# EAGLE design main (EAGLE 9.6.2)

## Sheet 1 of 4
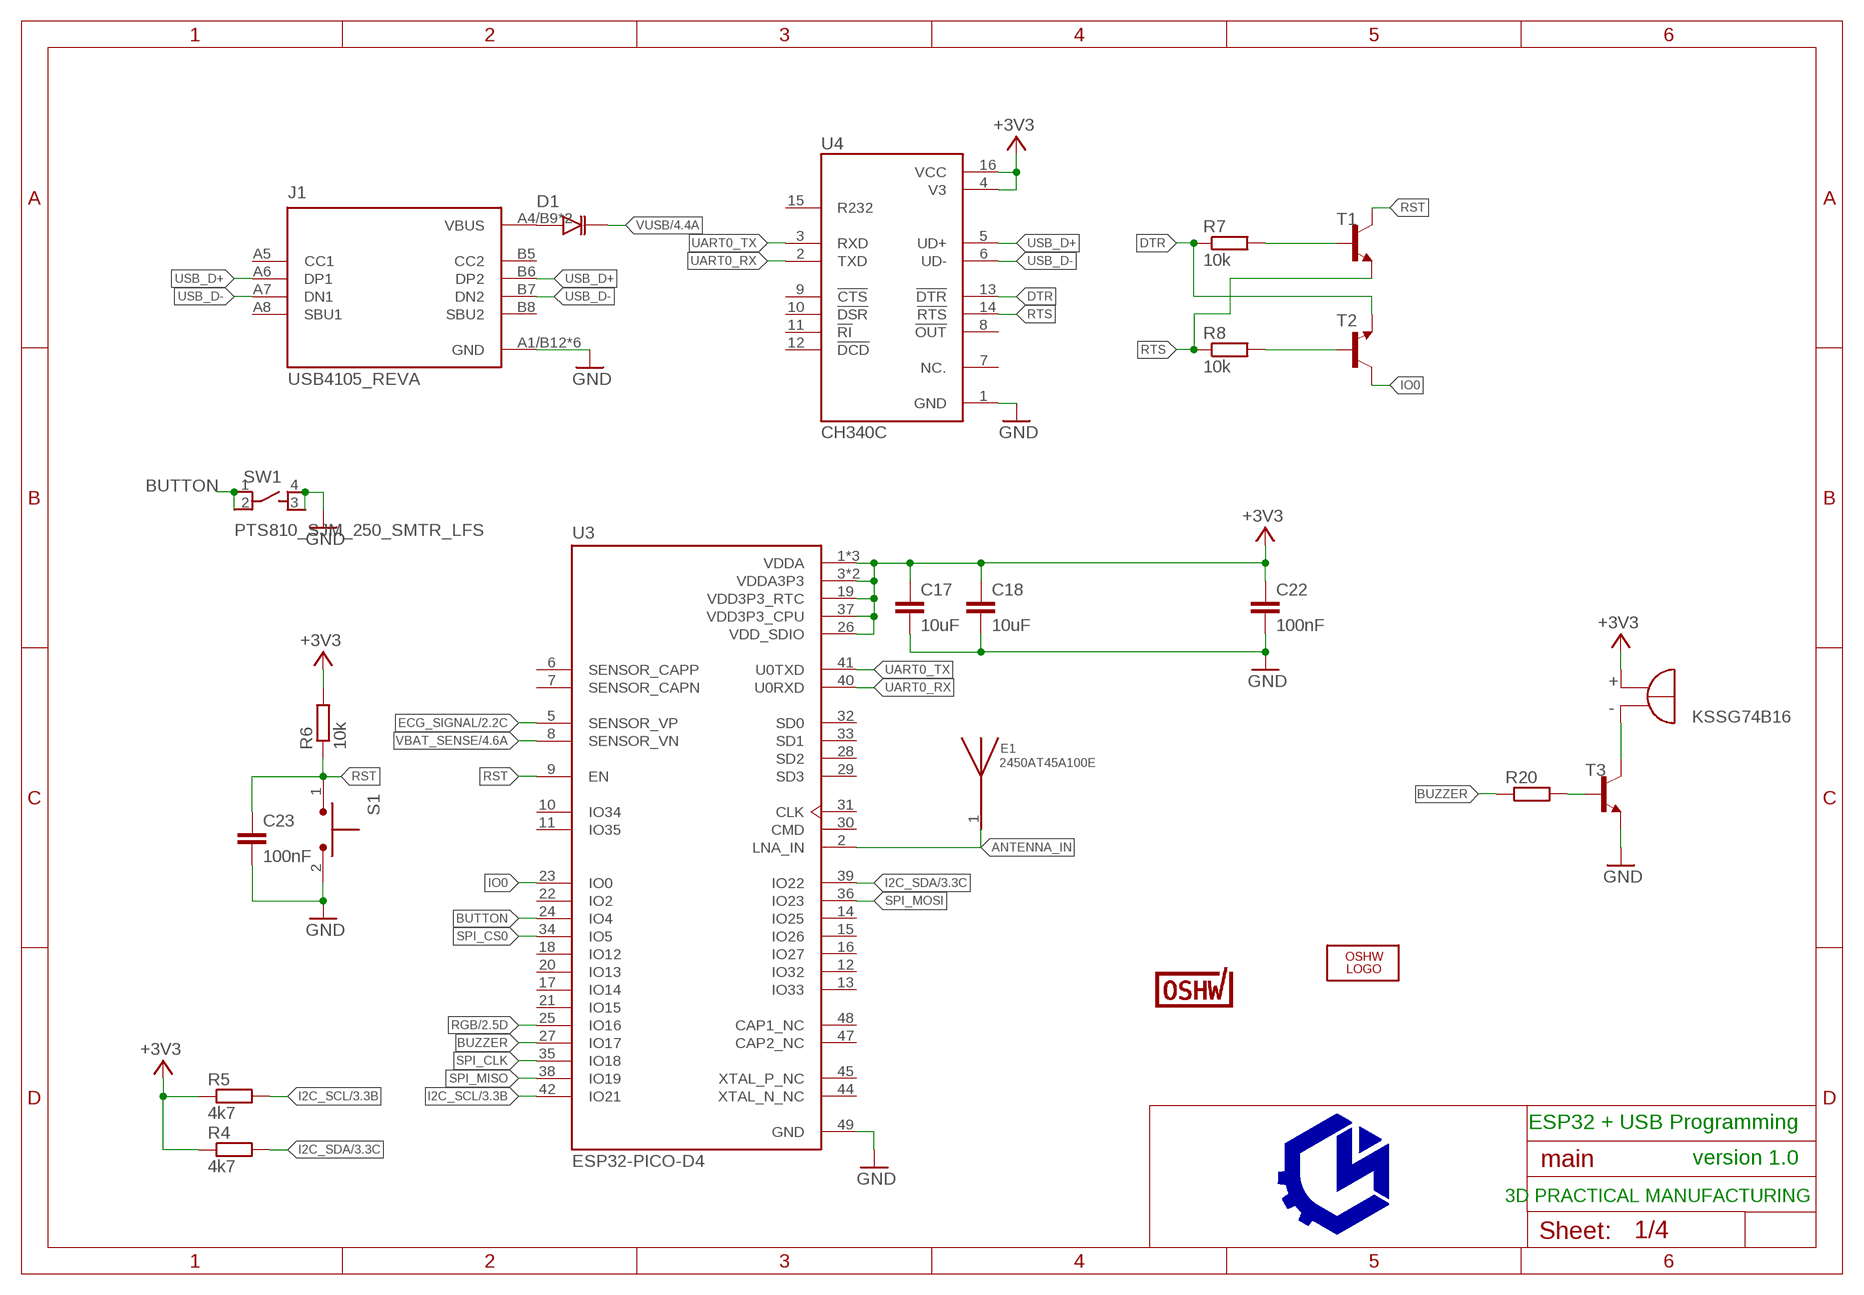
[diagram p0: schematic, sheet 1]

### Parts
C17  10uF  C-EUC0603  [C0603]
C18  10uF  C-EUC0603  [C0603]
C22  100nF  C-EUC0603  [C0603]
C23  100nF  C-EUC0603  [C0603]
D1  ZMV829BTA  [SOD2512X116N]
E1  2450AT45A100E  [ANT_2450AT45A100E]
J1  USB4105_REVA  [GCT_USB4105_REVA]
LOGO2  OSHW_LOGO_FILLX0200-NT  [OSHW_FILLX200_NOTEXT]
LS1  KSSG74B16  [XDCR_KSSG74B16]
R4  4k7  R-EU_R0603  [R0603]
R5  4k7  R-EU_R0603  [R0603]
R6  10k  R-EU_R0603  [R0603]
R7  10k  R-EU_R0603  [R0603]
R8  10k  R-EU_R0603  [R0603]
R20  R-EU_R0603  [R0603]
S1  TL1015AF160QG  [SW_TL1015AF160QG]
SW1  PTS810_SJM_250_SMTR_LFS  [SW_PTS810_SJM_250_SMTR_LFS]
T1  MMBT4401LT1-NPN-SOT23-BEC  [SOT23-BEC]
T2  MMBT4401LT1-NPN-SOT23-BEC  [SOT23-BEC]
T3  MMBT4401LT1-NPN-SOT23-BEC  [SOT23-BEC]
U3  ESP32-PICO-D4  [PQFN50P700X700X104-49N]
U4  CH340C  [SOIC127P600X180-16N]
U$10  CERT-SMALL  [CERT-SMALL-SILK]

### Nets
+3V3: C17.1 C18.1 C22.1 LS1.P(POS) R4.1 R5.1 R6.2 U3.1(VDDA) U3.3(VDDA3P3) U3.4(VDDA3P3) U3.19(VDD3P3_RTC) U3.26(VDD_SDIO) U3.37(VDD3P3_CPU) U3.43(VDDA) U3.46(VDDA) U4.4(V3) U4.16(VCC) ; also sheet 2,3,4
ANTENNA_IN: E1.1 U3.2(LNA_IN)
BUTTON: SW1.1 SW1.2 U3.24(IO4)
BUZZER: R20.1 U3.27(IO17)
DTR: R7.1 T2.E U4.13(!DTR)
ECG_SIGNAL: U3.5(SENSOR_VP) ; also sheet 2
GND: C17.2 C18.2 C22.2 C23.2 J1.A1/B12(GND) J1.B1/A12(GND) J1.G1(GND) J1.G2(GND) J1.G3(GND) J1.G4(GND) S1.2 SW1.3 SW1.4 T3.E U3.49(GND) U4.1(GND) ; also sheet 2,3,4
I2C_SCL: R5.2 U3.42(IO21) ; also sheet 3
I2C_SDA: R4.2 U3.39(IO22) ; also sheet 3
IO0: T2.C U3.23(IO0)
N$1: R7.2 T1.B
N$2: R8.2 T2.B
N$5: R20.2 T3.B
N$20: D1.A J1.A4/B9(VBUS) J1.B4/A9(VBUS)
N$22: LS1.N(NEG) T3.C
RGB: U3.25(IO16) ; also sheet 2
RST: C23.1 R6.1 S1.1 T1.C U3.9(EN)
RTS: R8.1 T1.E U4.14(!RTS)
SPI_CLK: U3.35(IO18)
SPI_CS0: U3.34(IO5)
SPI_MISO: U3.38(IO19)
SPI_MOSI: U3.36(IO23)
UART0_RX: U3.40(U0RXD) U4.2(TXD)
UART0_TX: U3.41(U0TXD) U4.3(RXD)
USB_D+: J1.A6(DP1) J1.B6(DP2) U4.5(UD+)
USB_D-: J1.A7(DN1) J1.B7(DN2) U4.6(UD-)
VBAT_SENSE: U3.8(SENSOR_VN) ; also sheet 4
VUSB: D1.K ; also sheet 4
Unconnected: J1.A5(CC1) J1.A8(SBU1) J1.B5(CC2) J1.B8(SBU2) U3.6(SENSOR_CAPP) U3.7(SENSOR_CAPN) U3.10(IO34) U3.11(IO35) U3.12(IO32) U3.13(IO33) U3.14(IO25) U3.15(IO26) U3.16(IO27) U3.17(IO14) U3.18(IO12) U3.20(IO13) U3.21(IO15) U3.22(IO2) U3.28(SD2) U3.29(SD3) U3.30(CMD) U3.31(CLK) U3.32(SD0) U3.33(SD1) U3.44(XTAL_N_NC) U3.45(XTAL_P_NC) U3.47(CAP2_NC) U3.48(CAP1_NC) U4.7(NC.) U4.8(!OUT) U4.9(!CTS) U4.10(!DSR) U4.11(!RI) U4.12(!DCD) U4.15(R232)

### Notes on the sheet
- ESP32 + USB Programming
- version 1.0
- 3D PRACTICAL MANUFACTURING

## Sheet 2 of 4
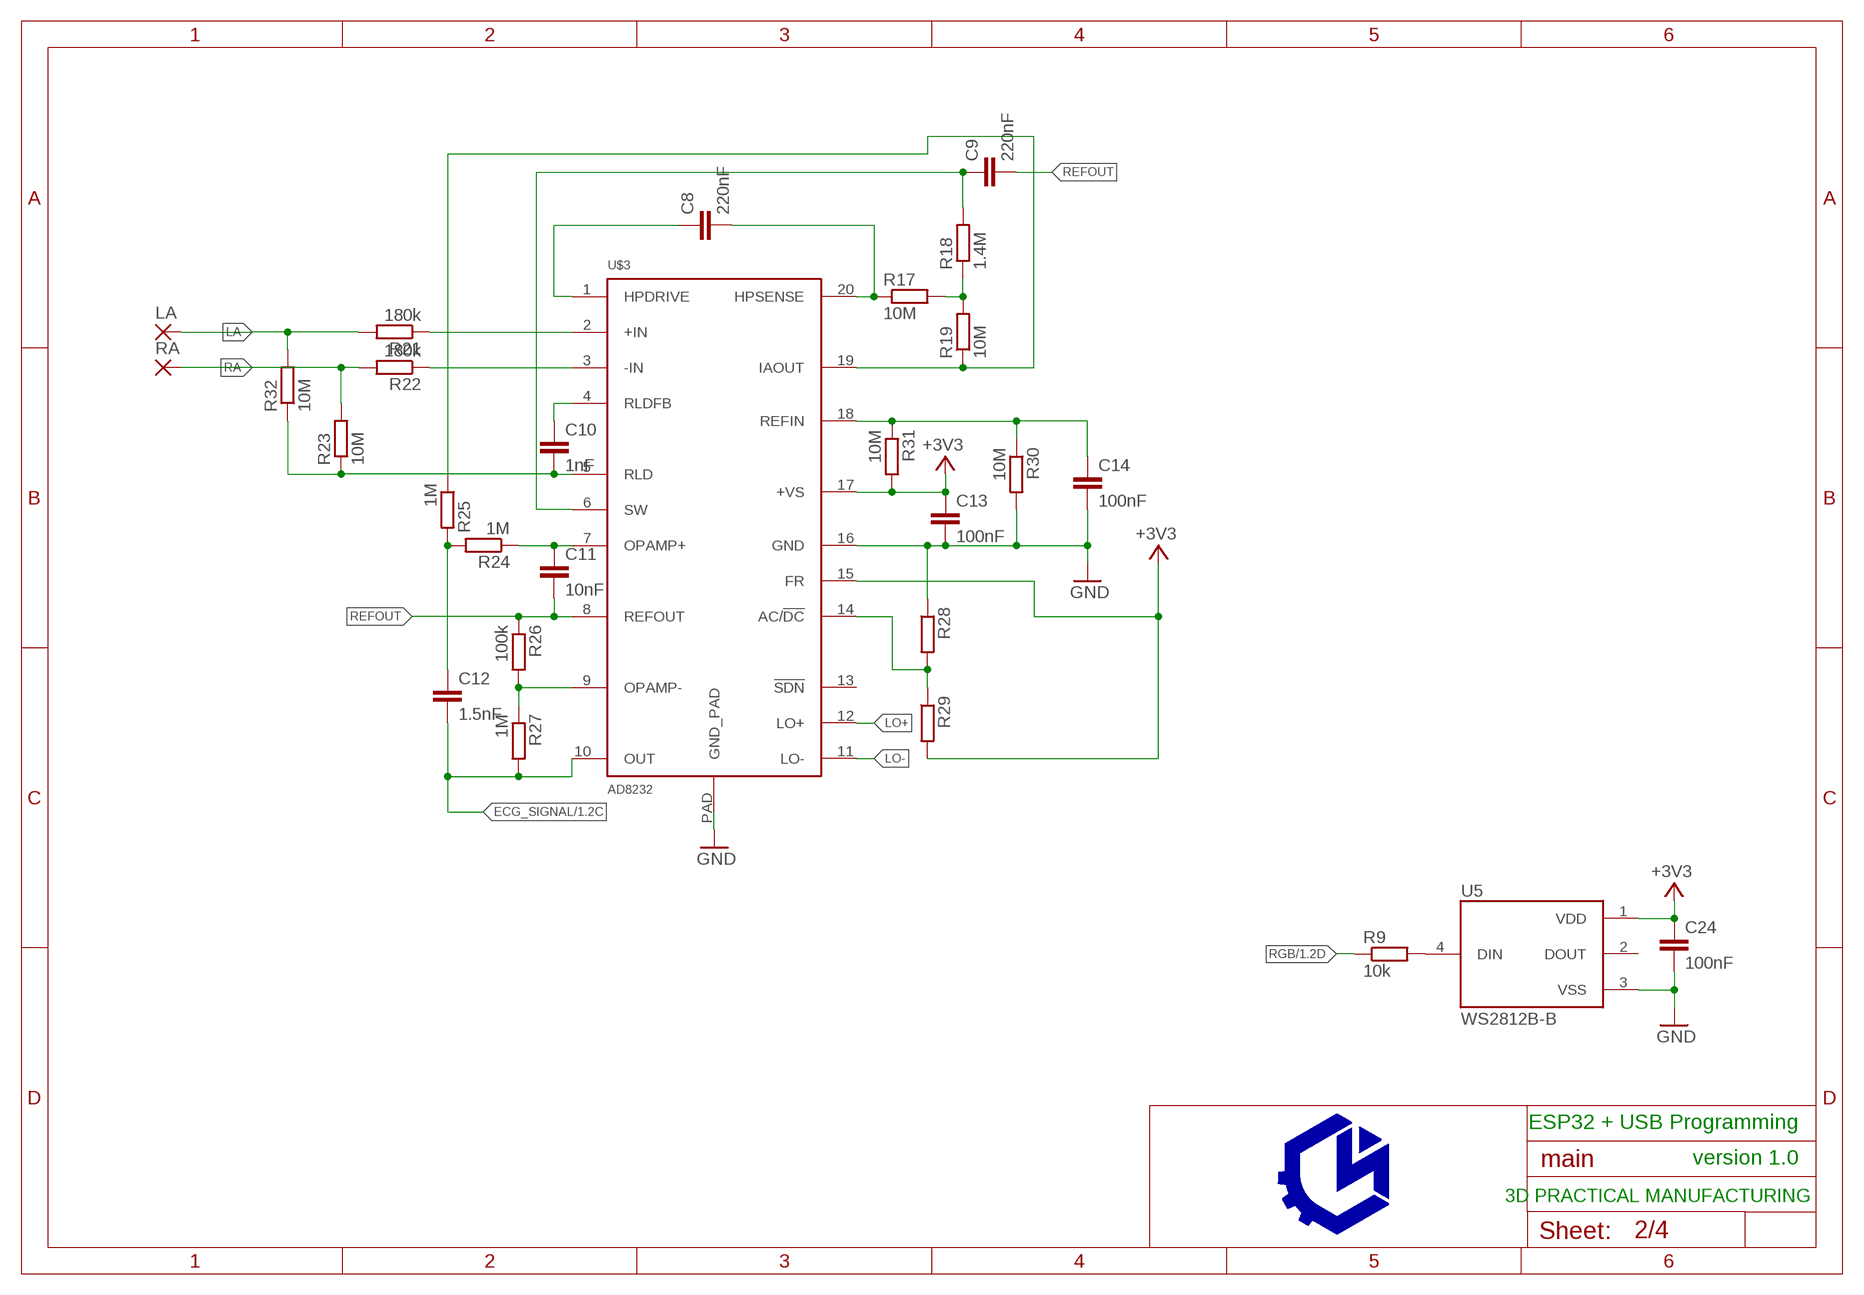
[diagram p1: schematic, sheet 2]

### Parts
C8  220nF  C-EUC0603  [C0603]
C9  220nF  C-EUC0603  [C0603]
C10  1nF  C-EUC0603  [C0603]
C11  10nF  C-EUC0603  [C0603]
C12  1.5nF  C-EUC0603  [C0603]
C13  100nF  C-EUC0603  [C0603]
C14  100nF  C-EUC0603  [C0603]
C24  100nF  C-EUC0603  [C0603]
LA  SMD2  [SMD1,27-2,54]
R9  10k  R-EU_R0603  [R0603]
R17  10M  R-EU_R0603  [R0603]
R18  1.4M  R-EU_R0603  [R0603]
R19  10M  R-EU_R0603  [R0603]
R21  180k  R-EU_R0603  [R0603]
R22  180k  R-EU_R0603  [R0603]
R23  10M  R-EU_R0603  [R0603]
R24  1M  R-EU_R0603  [R0603]
R25  1M  R-EU_R0603  [R0603]
R26  100k  R-EU_R0603  [R0603]
R27  1M  R-EU_R0603  [R0603]
R28  R-EU_R0603  [R0603]
R29  R-EU_R0603  [R0603]
R30  10M  R-EU_R0603  [R0603]
R31  10M  R-EU_R0603  [R0603]
R32  10M  R-EU_R0603  [R0603]
RA  SMD2  [SMD1,27-2,54]
U5  WS2812B-B  [LED_WS2812B-B]
U$3  AD8232  [LFCSP_20]

### Nets
+3V3: C13.1 C24.1 R29.2 R31.2 U5.1(VDD) U$3.15(FR) U$3.17(+VS) ; also sheet 1,3,4
ECG_SIGNAL: C12.2 R27.2 U$3.10(OUT) ; also sheet 1
GND: C13.2 C14.2 C24.2 R28.1 R30.2 U5.3(VSS) U$3.16(GND) U$3.PAD(GND_PAD) ; also sheet 1,3,4
LA: LA.1(P) R21.2 R32.2
LO+: U$3.12(LO+)
LO-: U$3.11(LO-)
N$3: R9.2 U5.4(DIN)
N$10: C8.2 R17.1 U$3.20(HPSENSE)
N$11: C8.1 U$3.1(HPDRIVE)
N$12: R19.1 R25.1 U$3.19(IAOUT)
N$13: R17.2 R18.1 R19.2
N$14: C9.1 R18.2 U$3.6(SW)
N$16: C12.1 R24.2 R25.2
N$18: R21.1 U$3.2(+IN)
N$19: R22.1 U$3.3(-IN)
N$30: C10.1 U$3.4(RLDFB)
N$31: C10.2 R23.1 R32.1 U$3.5(RLD)
N$34: C11.1 R24.1 U$3.7(OPAMP+)
N$36: R26.2 R27.1 U$3.9(OPAMP-)
N$38: R28.2 R29.1 U$3.14(AC/!DC)
N$39: C14.1 R30.1 R31.1 U$3.18(REFIN)
RA: R22.2 R23.2 RA.1(P)
REFOUT: C9.2 C11.2 R26.1 U$3.8(REFOUT)
RGB: R9.1 ; also sheet 1
Unconnected: U5.2(DOUT) U$3.13(!SDN)

### Notes on the sheet
- ESP32 + USB Programming
- version 1.0
- 3D PRACTICAL MANUFACTURING

## Sheet 3 of 4
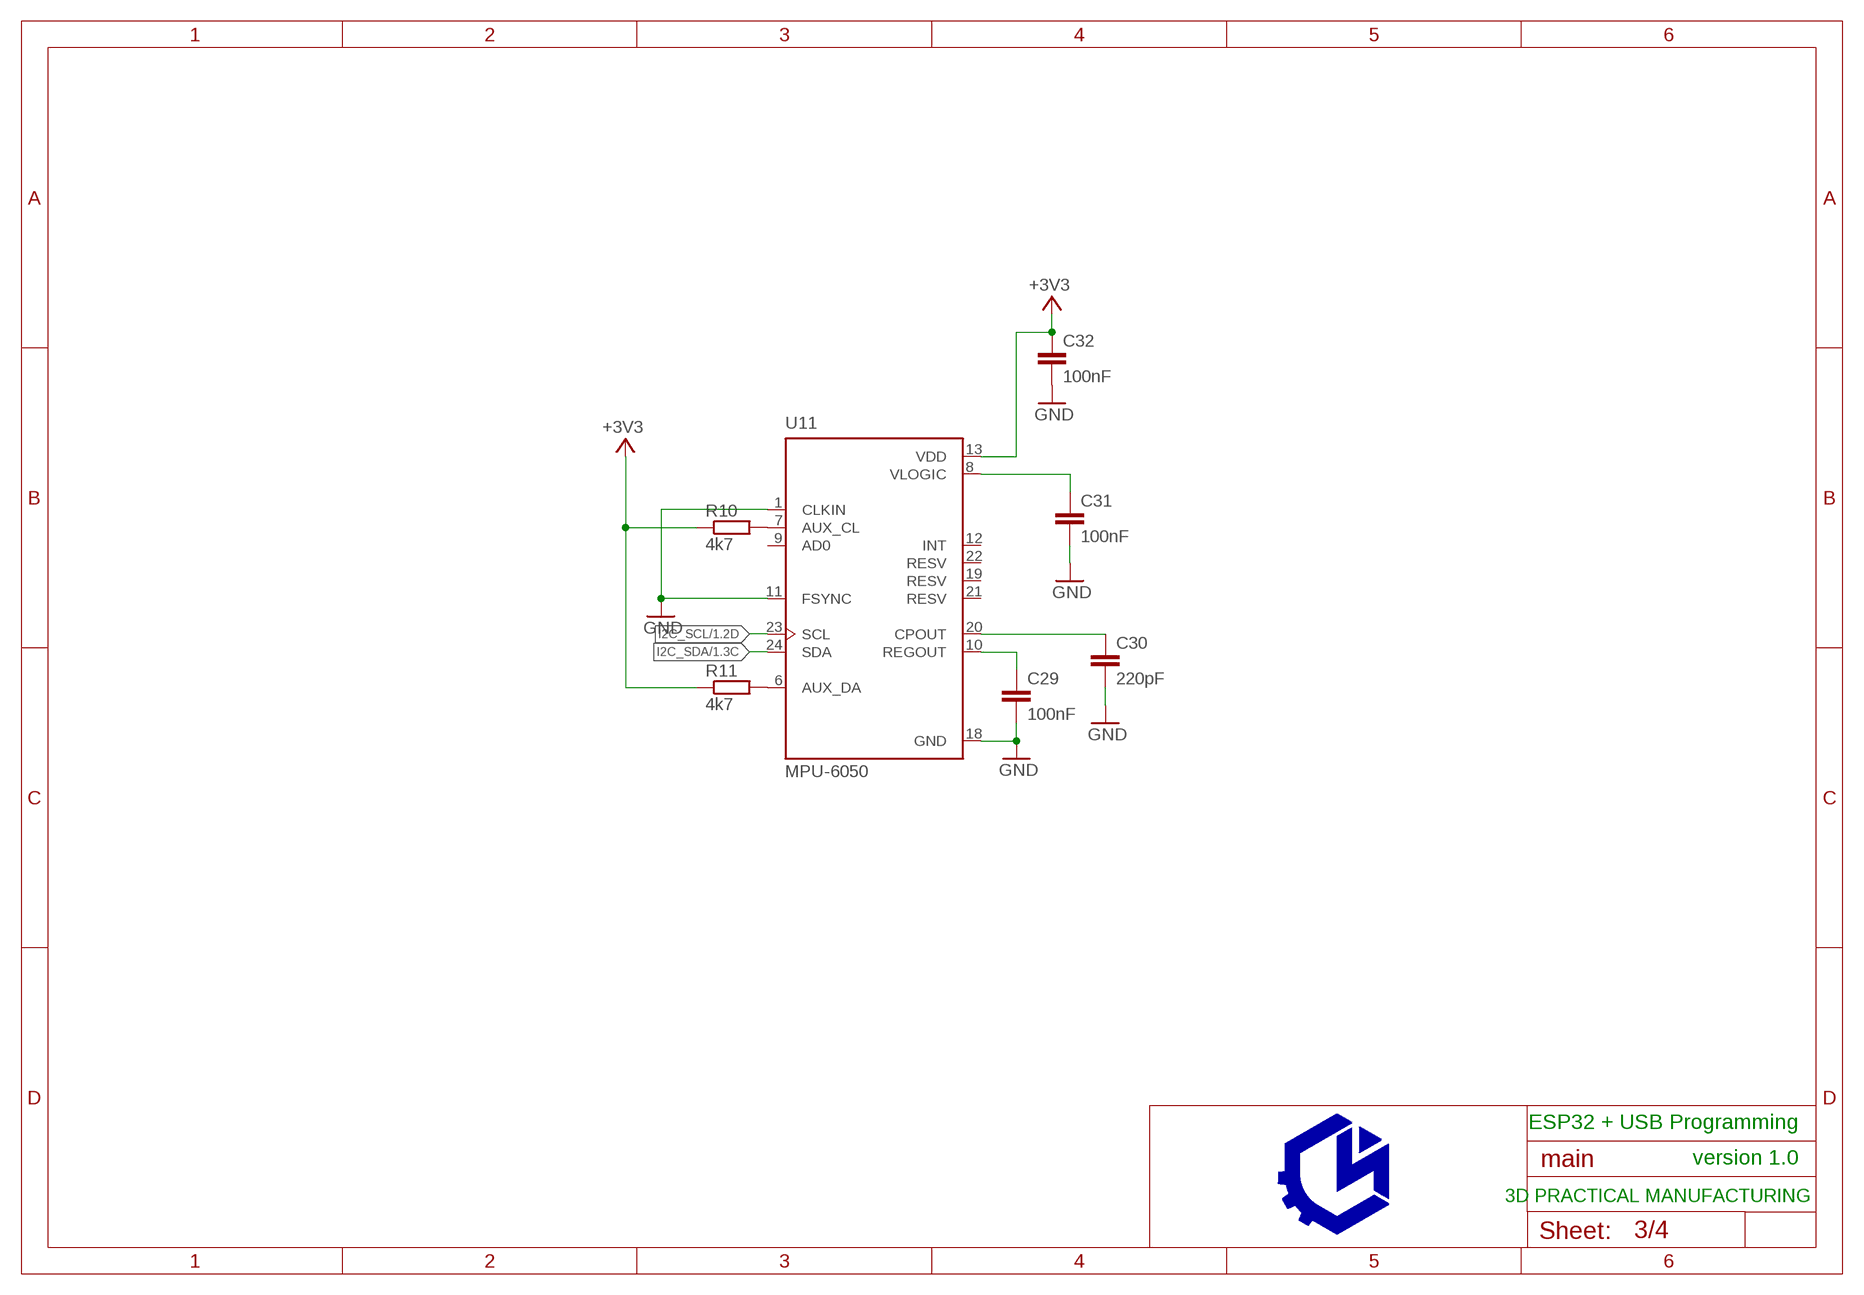
[diagram p2: schematic, sheet 3]

### Parts
C29  100nF  C-EUC0603  [C0603]
C30  220pF  C-EUC0603  [C0603]
C31  100nF  C-EUC0603  [C0603]
C32  100nF  C-EUC0603  [C0603]
R10  4k7  R-EU_R0603  [R0603]
R11  4k7  R-EU_R0603  [R0603]
U11  MPU-6050  [QFN50P400X400X95-24N]

### Nets
+3V3: C32.1 R10.1 R11.1 U11.13(VDD) ; also sheet 1,2,4
GND: C29.2 C30.2 C31.2 C32.2 U11.1(CLKIN) U11.11(FSYNC) U11.18(GND) ; also sheet 1,2,4
I2C_SCL: U11.23(SCL) ; also sheet 1
I2C_SDA: U11.24(SDA) ; also sheet 1
N$8: C29.1 U11.10(REGOUT)
N$24: R10.2 U11.7(AUX_CL)
N$25: R11.2 U11.6(AUX_DA)
N$26: C31.1 U11.8(VLOGIC)
N$27: C30.1 U11.20(CPOUT)
Unconnected: U11.9(AD0) U11.12(INT) U11.19(RESV) U11.21(RESV) U11.22(RESV)

### Notes on the sheet
- ESP32 + USB Programming
- version 1.0
- 3D PRACTICAL MANUFACTURING

## Sheet 4 of 4
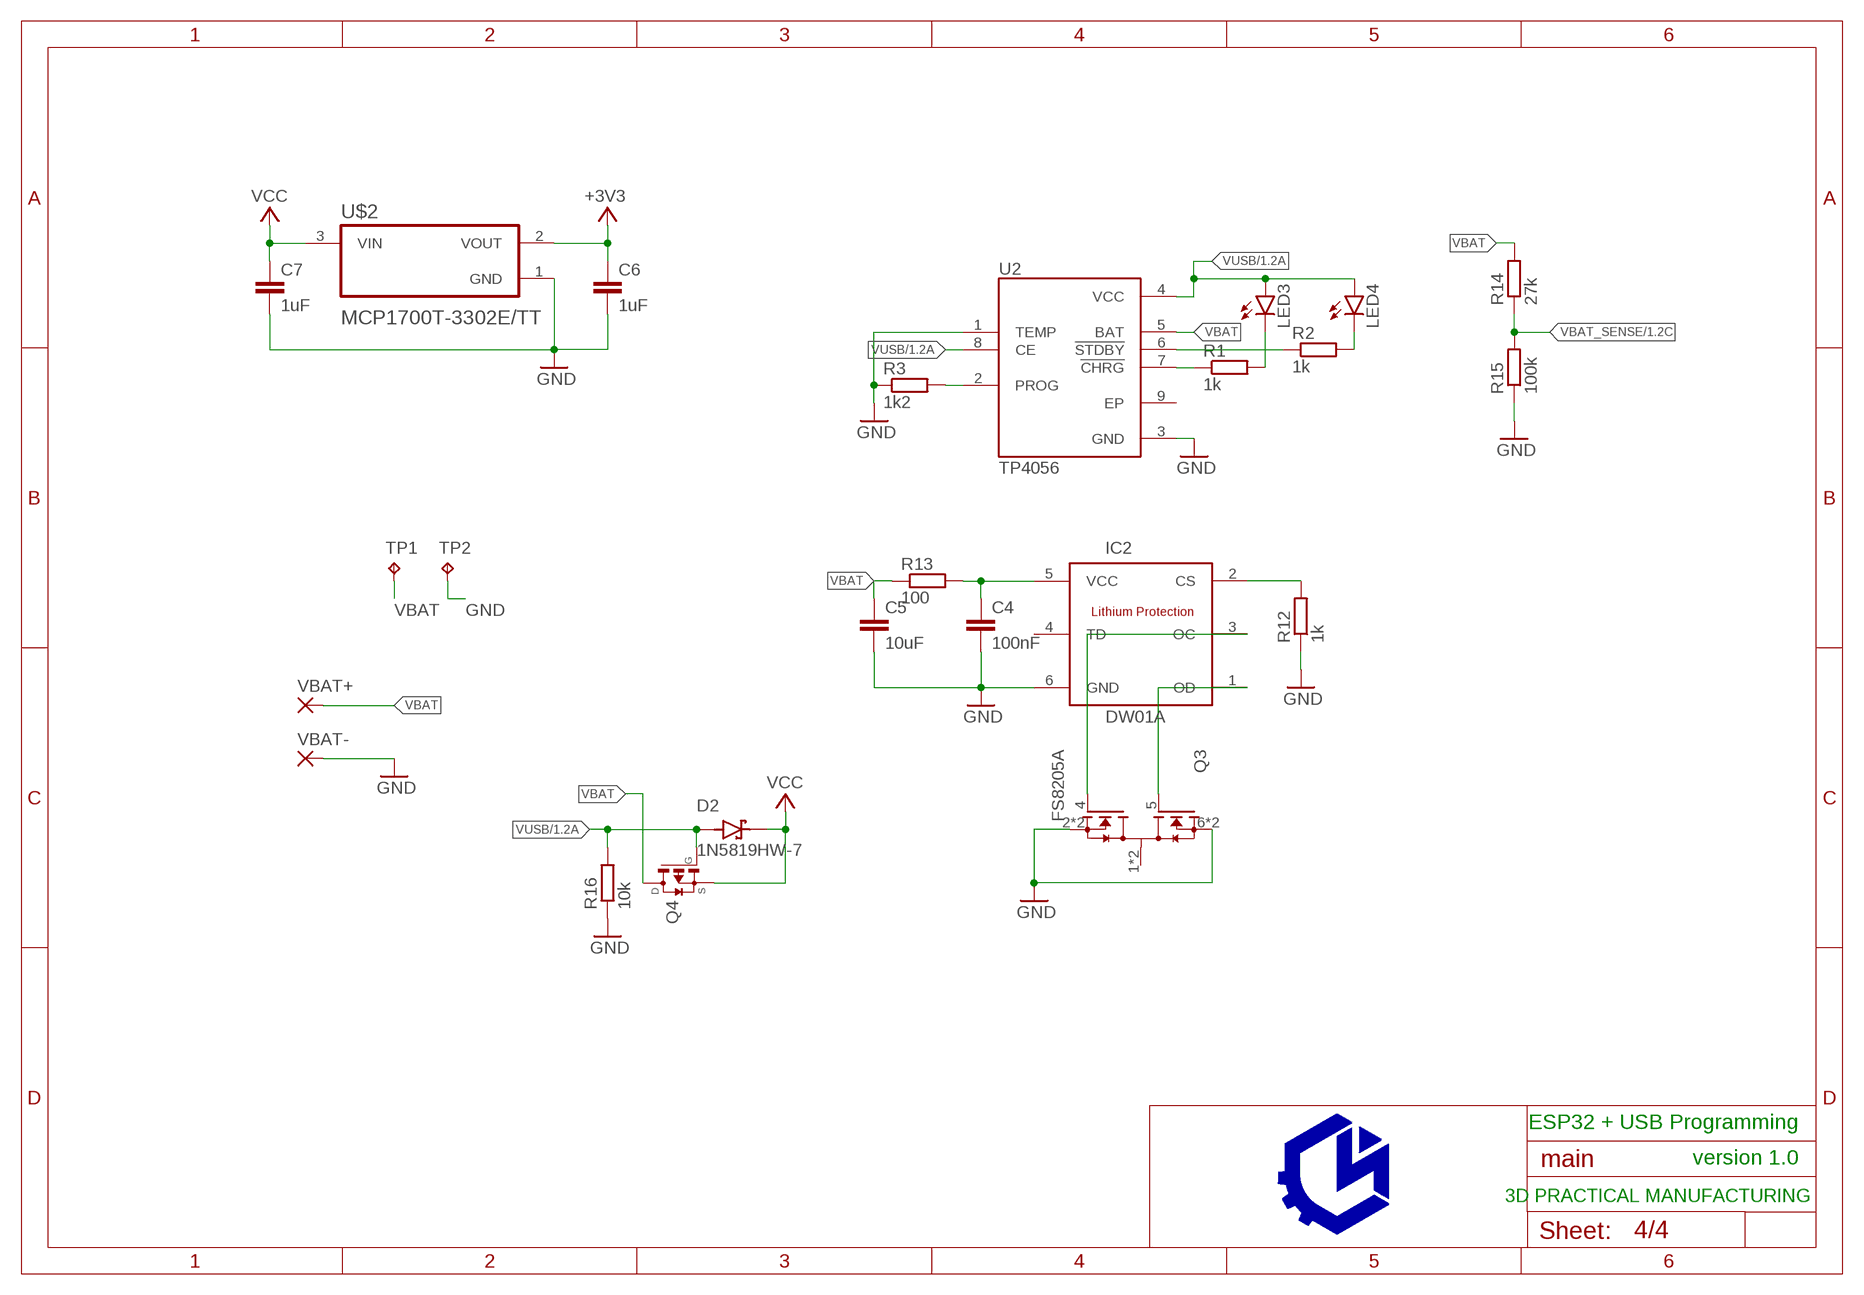
[diagram p3: schematic, sheet 4]

### Parts
C4  100nF  C-EUC0603  [C0603]
C5  10uF  C-EUC0603  [C0603]
C6  1uF  C-EUC0603  [C0603]
C7  1uF  C-EUC0603  [C0603]
D2  1N5819HW-7  [SOD3715X145N]
IC2  DW01A  [SOT23-6]
LED3  LEDCHIP-LED0603  [CHIP-LED0603]
LED4  LEDCHIP-LED0603  [CHIP-LED0603]
Q3  FS8205A  [SOP65P640X120-8N]
Q4  TRANSISTOR-FET_DMP2004K  [TRANSISTOR-FET_SOT23]
R1  1k  R-EU_R0603  [R0603]
R2  1k  R-EU_R0603  [R0603]
R3  1k2  R-EU_R0603  [R0603]
R12  1k  R-EU_R0603  [R0603]
R13  100  R-EU_R0603  [R0603]
R14  27k  R-EU_R0603  [R0603]
R15  100k  R-EU_R0603  [R0603]
R16  10k  R-EU_R0603  [R0603]
TP1  TPB1,27  [B1,27]
TP2  TPB1,27  [B1,27]
U2  TP4056  [SOP127P600X175-9N]
U$2  MCP1700T-3302E/TT  [SOT95P237X112-3N]
VBAT+  WIREPADSMD1,27-254  [SMD1,27-2,54]
VBAT-  WIREPADSMD1,27-254  [SMD1,27-2,54]

### Nets
+3V3: C6.1 U$2.2(VOUT) ; also sheet 1,2,3
GND: C4.2 C5.2 C6.2 C7.2 IC2.6(GND) Q3.2(S1) Q3.3(S1) Q3.6(S2) Q3.7(S2) R3.1 R12.1 R15.1 R16.1 TP2.TP U2.1(TEMP) U2.3(GND) U$2.1(GND) VBAT-.1(P) ; also sheet 1,2,3
N$4: R2.1 U2.6(!STDBY)
N$6: LED3.C R1.2
N$7: LED4.C R2.2
N$9: R1.1 U2.7(!CHRG)
N$17: R3.2 U2.2(PROG)
N$21: IC2.1(OD) Q3.5(G2)
N$23: IC2.3(OC) Q3.4(G1)
N$28: IC2.2(CS) R12.2
N$29: C4.1 IC2.5(VCC) R13.2
VBAT: C5.1 Q4.3(D) R13.1 R14.2 TP1.TP U2.5(BAT) VBAT+.1(P)
VBAT_SENSE: R14.1 R15.2 ; also sheet 1
VCC: C7.1 D2.C(K) Q4.2(S) U$2.3(VIN)
VUSB: D2.A LED3.A LED4.A Q4.1(G) R16.2 U2.4(VCC) U2.8(CE) ; also sheet 1
Unconnected: IC2.4(TD) Q3.1(D12) Q3.8(D12) U2.9(EP)

### Notes on the sheet
- ESP32 + USB Programming
- version 1.0
- 3D PRACTICAL MANUFACTURING

## Library data of the parts
C4-C14 C17 C18 C22-C24 C29-C32 = rcl:C-EU: CAPACITOR, European symbol; SPICEPREFIX: C
D1 = ZMV829BTA:ZMV829BTA: Varactors Single 25V Surface Mount SOD-323 Check availability <https://pricing.snapeda.com/parts/ZMV829BTA/Diodes%20Inc./view-part?ref=eda>; AVAILABILITY: In Stock; DESCRIPTION: Varactors Single 25 V Surface Mount SOD-323; MF: Diodes Inc.; MP: ZMV829BTA; PACKAGE: SOD-323 Diodes Inc.; PRICE: None; PURCHASE-URL: https://pricing.snapeda.com/search/part/ZMV829BTA/?ref=eda
D2 = 1N5819HW-7:1N5819HW-7: 1N5819HW Series 40 V 1 A Surface Mount Schottky Barrier Rectifier - SOD-123 Check availability <https://pricing.snapeda.com/parts/1N5819HW-7/Diodes%20Inc./view-part?ref=eda>; AVAILABILITY: In Stock; DESCRIPTION: Diode Schottky 40 V 1A Surface Mount SOD-123; MF: Diodes Inc.; MP: 1N5819HW-7; PACKAGE: SOD-123 Fairchild Semiconductor; PRICE: None; PURCHASE-URL: https://pricing.snapeda.com/search/part/1N5819HW-7/?ref=eda
E1 = 2450AT45A100E:2450AT45A100E: ANTENNA, CERAMIC, 2.45GHZ; Bandwidth: 100MHz; Frequency: 2.45GHz; Gain: 1dB; Impedance: 50ohm Check availability <https://pricing.snapeda.com/parts/2450AT45A100E/Johanson%20Technology/view-part?ref=eda>; AVAILABILITY: In Stock; DESCRIPTION: 2.4GHz - Chip RF Antenna 2.4GHz ~ 2.5GHz 2.2dBi Solder Surface Mount; MF: Johanson Technology; MP: 2450AT45A100E; PACKAGE: None; PRICE: None; PURCHASE-URL: https://pricing.snapeda.com/search/part/2450AT45A100E/?ref=eda
IC2 = DW01A:DW01A: Check availability <https://pricing.snapeda.com/parts/DW01A/Fortune%20Semiconductor/view-part?ref=eda>; AVAILABILITY: Not in stock; DESCRIPTION: One Cell Lithium-ion/Polymer Battery Protection IC; MF: Fortune Semiconductor; MP: DW01A; PACKAGE: SOT-23-6 Fortune Semiconductor; PRICE: None
J1 = USB4105_REVA:USB4105_REVA: USB Type C Receptacle for USB 2.0 SMT Type, PCB Top Mount; AVAILABILITY: Unavailable; DESCRIPTION: USB-C (USB TYPE-C) USB 2.0 Receptacle Connector 24 (16+8 Dummy) Position Surface Mount, Right Angle; Through Hole; MF: Global Connector Technology; MP: USB4105; PACKAGE: Package; PRICE: None
LA RA = wirepad:SMD2: SMD PAD
LED3 LED4 = led:LED: LED OSRAM: - CHIPLED LG R971, LG N971, LY N971, LG Q971, LY Q971, LO R971, LY R971 LH N974, LH R974 LS Q976, LO Q976, LY Q976 LO Q996 - Hyper CHIPLED LW Q18S LB Q993, LB Q99A, LB R99A - SideLED LS A670, LO A670, LY A670, LG A670, LP A670 LB A673, LV A673, LT A673, LW A673 LH A674 LY A675 LS A676, LA A676, LO A676, LY A676, LW A676 LS A679, LY A679, LG A679 - Hyper Micro SIDELED® LS Y876, LA Y876, LO Y876, LY Y876 LT Y87S - SmartLED LW L88C, LW L88S LB L89C, LB L89S, LG L890 LS L89K, LO L89K, LY L89K LS L896, LA L896, LO L896, LY L896 - TOPLED LS T670, LO T670, LY T670, LG T670, LP T670 LSG T670, LSP T670, LSY T670, LOP T670, LYG T670 LG T671, LOG T671, LSG T671 LB T673, LV T673, LT T673, LW T673 LH T674 LS T676, LA T676, LO T676, LY T676, LB T676, LH T676, LSB T676, LW T676 LB T67C, LV T67C, LT T67C, LS T67K, LO T67K, LY T67K, LW E67C LS E67B, LA E67B, LO E67B, LY E67B, LB E67C, LV E67C, LT E67C LW T67C LS T679, LY T679, LG T679 LS T770, LO T770, LY T770, LG T770, LP T770 LB T773, LV T773, LT T773, LW T773 LH T774 LS E675, LA E675, LY E675, LS T675 LS T776, LA T776, LO T776, LY T776, LB T776 LHGB T686 LT T68C, LB T68C - Hyper Mini TOPLED® LB M676 - Mini TOPLED Santana® LG M470 LS M47K, LO M47K, LY M47K Source: http://www.osram.convergy.de LUXEON: - LUMILED® LXK2-PW12-R00, LXK2-PW12-S00, LXK2-PW14-U00, LXK2-PW14-V00 LXK2-PM12-R00, LXK2-PM12-S00, LXK2-PM14-U00 LXK2-PE12-Q00, LXK2-PE12-R00, LXK2-PE12-S00, LXK2-PE14-T00, LXK2-PE14-U00 LXK2-PB12-K00, LXK2-PB12-L00, LXK2-PB12-M00, LXK2-PB14-N00, LXK2-PB14-P00, LXK2-PB14-Q00 LXK2-PR12-L00, LXK2-PR12-M00, LXK2-PR14-Q00, LXK2-PR14-R00 LXK2-PD12-Q00, LXK2-PD12-R00, LXK2-PD12-S00 LXK2-PH12-R00, LXK2-PH12-S00 LXK2-PL12-P00, LXK2-PL12-Q00, LXK2-PL12-R00 Source: www.luxeon.com KINGBRIGHT: KA-3528ASYC Source: www.kingbright.com
LOGO2 = ohw-logo:OSHW_LOGO_FILL
LS1 = KSSG74B16:KSSG74B16: Check availability <https://pricing.snapeda.com/parts/KSSG74B16/Kingstate/view-part?ref=eda>; AVAILABILITY: In Stock; DESCRIPTION: 8.5mm, 3.6V, 2.73KHz, 87dB, High SPL Magnetic Buzzer, SMT; MF: Kingstate; MP: KSSG74B16; PACKAGE: DIP-16 kingstate; PRICE: None
Q3 = FS8205A:FS8205A: N/A Check availability <https://pricing.snapeda.com/parts/FS8205A/Fortune%20Semiconductor/view-part?ref=eda>; AVAILABILITY: Not in stock; MF: Fortune Semiconductor; MP: FS8205A; PACKAGE: Package; PRICE: None
Q4 = 52101-101-REV-A_v16:TRANSISTOR-FET_DMP2004K: P-Channel Enhancement MOSFET
R1-R32 = rcl:R-EU_: RESISTOR, European symbol; SPICEPREFIX: R
S1 = TL1015AF160QG:TL1015AF160QG: Tactile Switch SPST-NO Top Actuated Surface Mount Check prices <https://pricing.snapeda.com/parts/TL1015AF160QG/E-Switch/view-part?ref=eda>; AVAILABILITY: In Stock; DESCRIPTION: Tactile Switch SPST-NO Top Actuated Surface Mount; MF: E-Switch; MP: TL1015AF160QG; PACKAGE: SOIC-14 E-Switch; PRICE: None; PURCHASE-URL: https://pricing.snapeda.com/search/part/TL1015AF160QG/?ref=eda
SW1 = PTS810_SJM_250_SMTR_LFS:PTS810_SJM_250_SMTR_LFS: Switch Tactile Spst-No 0.05a 16v Check prices <https://pricing.snapeda.com/parts/PTS810%20SJM%20250%20SMTR%20LFS/C%26K/view-part?ref=eda>; AVAILABILITY: In Stock; DESCRIPTION: Tactile Switch SPST-NO Top Actuated Surface Mount; MF: C&K; MP: PTS810 SJM 250 SMTR LFS; PACKAGE: None; PRICE: None; PURCHASE-URL: https://pricing.snapeda.com/search/part/PTS810 SJM 250 SMTR LFS/?ref=eda
T1-T3 = DC_LOAD_AU:*-NPN-: NPN Transistror BF959 corrected 2008.03.06
TP1 TP2 = testpad:TP: Test pad
U2 = TP4056:TP4056: Complete single cell Li-Ion battery with a constant current / constant voltage linear charger Check availability <https://pricing.snapeda.com/parts/TP4056/NanJing%20Top%20Power%20ASIC%20Corp./view-part?ref=eda>; AVAILABILITY: Not in stock; DESCRIPTION: Complete single cell Li-Ion battery with a constant current / constant voltage linear charger; MF: NanJing Top Power ASIC Corp.; MP: TP4056; PACKAGE: None; PRICE: None
U3 = ESP32-PICO-D4:ESP32-PICO-D4: Bluetooth, WiFi 802.11b/g/n, Bluetooth v4.2 +EDR, Class 1, 2 and 3 Transceiver Module 2.4GHz ~ 2.5GHz Surface Mount Check availability <https://pricing.snapeda.com/parts/ESP32-PICO-D4/Espressif%20Systems/view-part?ref=eda>; AVAILABILITY: In Stock; DESCRIPTION: Bluetooth, WiFi 802.11b/g/n, Bluetooth v4.2 +EDR, Class 1, 2 and 3 Transceiver Module 2.4GHz ~ 2.5GHz - Surface Mount; MF: Espressif Systems; MP: ESP32-PICO-D4; PACKAGE: SMD-48 Espressif Systems; PRICE: None; PURCHASE-URL: https://pricing.snapeda.com/search/part/ESP32-PICO-D4/?ref=eda
U4 = CH340C:CH340C: USB to serial chip CH340 Check availability <https://pricing.snapeda.com/parts/CH340C/WCH/view-part?ref=eda>; AVAILABILITY: Not in stock; DESCRIPTION: USB to serial chip CH340; MF: WCH; MP: CH340C; PACKAGE: None; PRICE: None
U5 = WS2812B-B:WS2812B-B: Intelligent control LED integrated light source Check availability <https://pricing.snapeda.com/parts/WS2812B-B/Worldsemi/view-part?ref=eda>; AVAILABILITY: Not in stock; DESCRIPTION: Intelligent control LED integrated light source; MF: Worldsemi; MP: WS2812B-B; PACKAGE: Package; PRICE: None
U11 = MPU-6050:MPU-6050: MPU-6050 Six-Axis (Gyro + Accelerometer) MEMS MotionTracking™ Devices Check availability <https://pricing.snapeda.com/parts/MPU-6050/TDK%20InvenSense/view-part?ref=eda>; AVAILABILITY: In Stock; DESCRIPTION: MPU-6050 series Accelerometer, Gyroscope, 3 Axis Sensor Evaluation Board; MF: TDK InvenSense; MP: MPU-6050; PACKAGE: QFN-24 InvenSense; PRICE: None; PURCHASE-URL: https://pricing.snapeda.com/search/part/MPU-6050/?ref=eda
U$2 = MCP1700T-3302E_TT:MCP1700T-3302E/TT: Check availability <https://pricing.snapeda.com/parts/MCP1700T-3302E/TT/Microchip/view-part?ref=eda>; AVAILABILITY: In Stock; DESCRIPTION: Linear Voltage Regulator IC Positive Fixed 1 Output 250mA SOT-23-3; MF: Microchip; MP: MCP1700T-3302E/TT; PACKAGE: SOT-23 Microchip; PRICE: None; PURCHASE-URL: https://pricing.snapeda.com/search/part/MCP1700T-3302E/TT/?ref=eda
U$3 = AD8232:AD8232: Check availability <https://pricing.snapeda.com/parts/AD8232/Analog%20Devices%2C%20Inc./view-part?ref=eda>; AVAILABILITY: In Stock; DESCRIPTION: AD8232 Analog Front End Evaluation Board; MF: Analog Devices, Inc.; MP: AD8232; PACKAGE: None; PRICE: None; PURCHASE-URL: https://pricing.snapeda.com/search/part/AD8232/?ref=eda
U$10 = OSHWA:CERT
VBAT+ VBAT- = wirepad:WIREPAD: Wire PAD connect wire on PCB

## Board
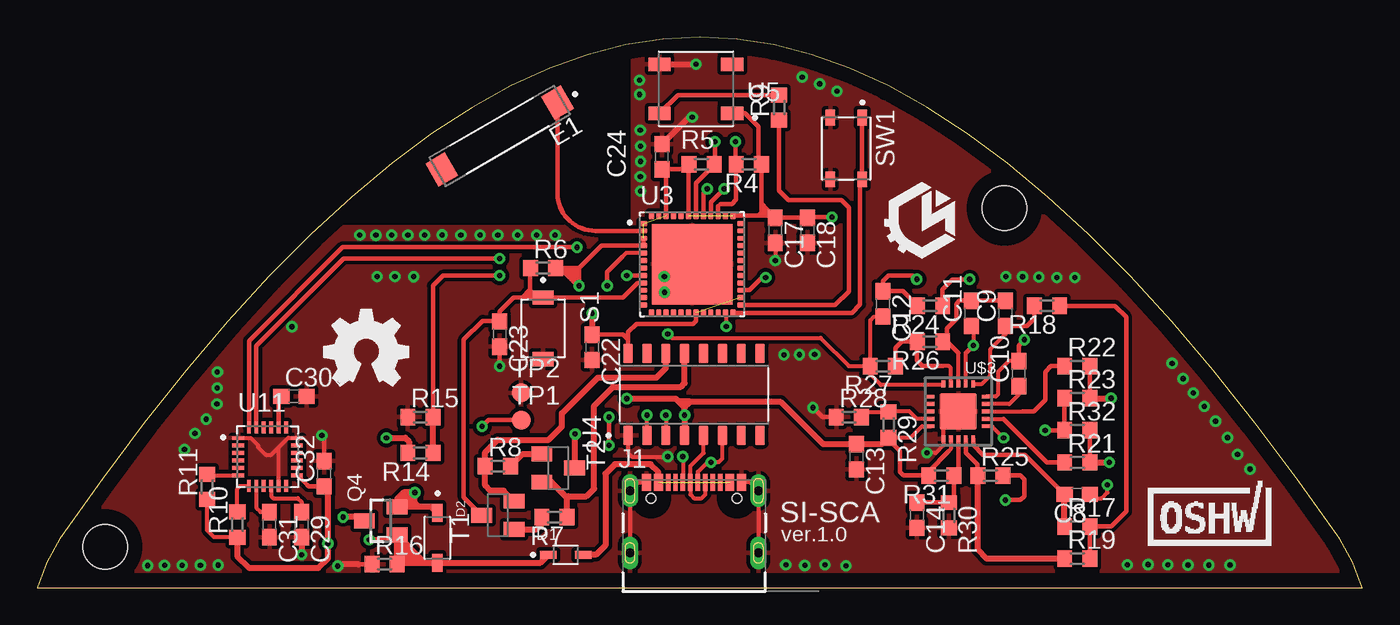
[diagram p4: board, top side]
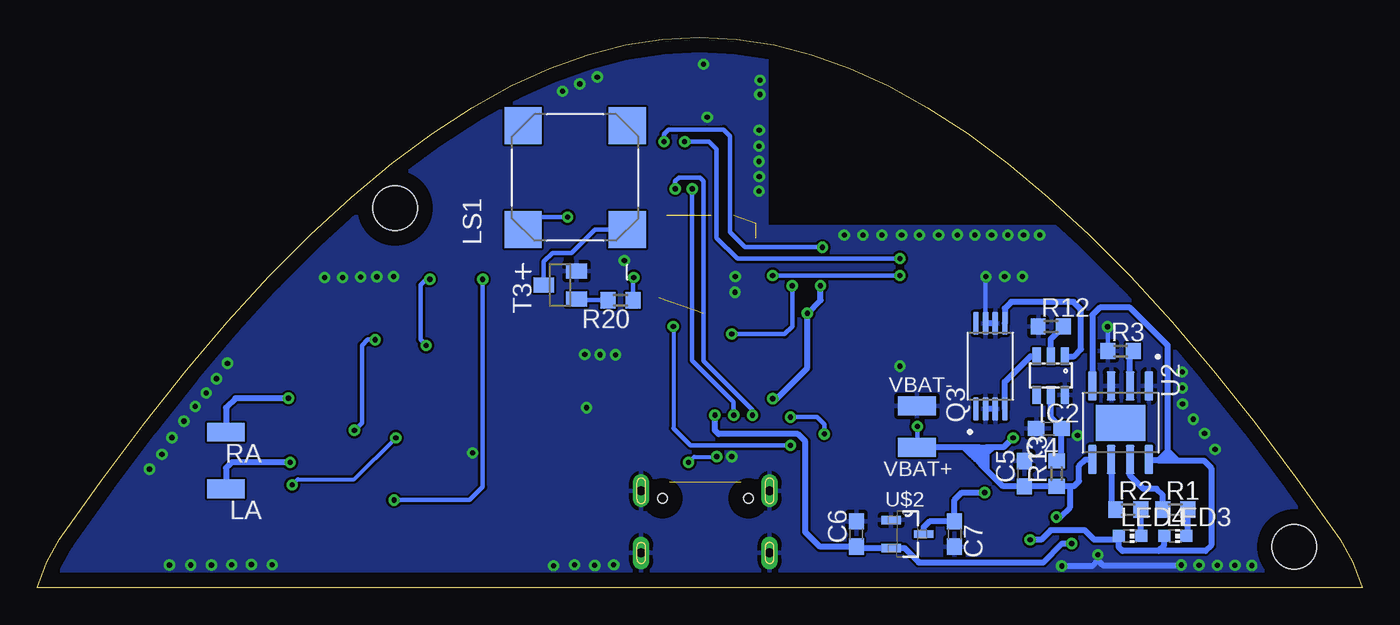
[diagram p5: board, bottom side, seen from below]

Size 89.17 x 37.05 mm. Coordinates in mm from the lower left corner, seen from the top.
Outline: 1.53,3.27 0.63,1.7 0,0 89.17,0 88.55,1.69 87.65,3.27 84.81,7.28 81.98,11.07 79.16,14.61 76.35,17.91 73.56,20.96 70.78,23.75 68.03,26.29 65.29,28.56 62.59,30.57 59.91,32.31 57.27,33.77 54.67,34.96 52.1,35.88 49.58,36.54 47.08,36.93 44.59,37.05 42.1,36.92 39.6,36.53 37.07,35.88 34.5,34.96 31.9,33.77 29.26,32.31 26.59,30.58 23.88,28.57 21.15,26.29 18.39,23.76 15.62,20.96 12.82,17.91 10.01,14.61 7.19,11.07 4.36,7.28 1.53,3.27
Copper layers (1*16): Top 0.035mm / dielectric 1.5mm / Bottom 0.035mm
Design rules "default *": minimum track width 6mil, minimum drill 0.35mm, track to track 6mil, track to pad 6mil, pad to pad 6mil, via to via 6mil, smd to smd 6mil, copper to edge 40mil, drill to drill 6mil, minimum pad ring 10mil, minimum via ring 8mil, stop-mask expansion 4mil, vias tented up to drill 14mil, thermal gap 10mil
Holes 3 mm at 4.57,2.75 65.09,25.55

### Footprints (pad centres in the part's own frame; a part is rotated, then mirrored left to right if it is on the bottom)
C0603 = smd 1.1 x 1: 1 -0.85,0; 2 0.85,0
SOD2512X116N = smd 1.11 x 0.52: A 1.165,0; K -1.165,0
SOD3715X145N = smd 1.21 x 0.73: A 1.68,0; C -1.68,0
ANT_2450AT45A100E = smd 1.5 x 1.8: 1 -4.5,0; 2 4.5,0
SOT23-6 = smd 0.55 x 1.2: 1 -0.95,-1.3; 2 0,-1.3; 3 0.95,-1.3; 4 0.95,1.3; 5 0,1.3; 6 -0.95,1.3
GCT_USB4105_REVA = smd 0.6 x 1.15: A1/B12 -3.2,4.755; A4/B9 -2.4,4.755; B1/A12 3.2,4.755; B4/A9 2.4,4.755 | smd 0.3 x 1.15: A5 -1.25,4.755; A6 -0.25,4.755; A7 0.25,4.755; A8 1.25,4.755; B5 1.75,4.755; B6 0.75,4.755; B7 -0.75,4.755; B8 -1.75,4.755 | drill 0.6 pad 1 long: G1 -4.32,0; G2 4.32,0 | drill 0.6 pad 1.05 long: G3 -4.32,4.18; G4 4.32,4.18 | hole 0.65: 2.89,3.68; -2.89,3.68
SMD1,27-2,54 = smd 1.27 x 2.54: 1 0,0
CHIP-LED0603 = smd 0.8 x 0.8: A 0,-0.75; C 0,0.75
XDCR_KSSG74B16 = smd 2.5 x 2.5: N -3.5,-3.5; NC1 3.5,3.5; NC2 3.5,-3.5; P -3.5,3.5
SOP65P640X120-8N = smd 1.56 x 0.4: 1 -2.88,0.975; 2 -2.88,0.325; 3 -2.88,-0.325; 4 -2.88,-0.975; 5 2.88,-0.975; 6 2.88,-0.325; 7 2.88,0.325; 8 2.88,0.975
TRANSISTOR-FET_SOT23 = smd 1 x 1.4: 1 -0.95,-1.1; 2 0.95,-1.1; 3 0,1.1
R0603 = smd 1 x 1.1: 1 -0.85,0; 2 0.85,0
SW_TL1015AF160QG = smd 0.95 x 1.4: 1 -2.075,0; 2 2.075,0
SW_PTS810_SJM_250_SMTR_LFS = smd 1.05 x 0.65: 1 -2.075,1.075; 2 2.075,1.075; 3 -2.075,-1.075; 4 2.075,-1.075
SOT23-BEC = smd 1 x 1.4: B -0.95,-1.1; C 0,1.1; E 0.95,-1.1
B1,27 = smd 1.27 x 1.27: TP 0,0
SOP127P600X175-9N = smd 1.97 x 0.6: 1 -2.475,1.905; 2 -2.475,0.635; 3 -2.475,-0.635; 4 -2.475,-1.905; 5 2.475,-1.905; 6 2.475,-0.635; 7 2.475,0.635; 8 2.475,1.905 | smd 2.413 x 3.302: 9 0,0
PQFN50P700X700X104-49N = smd 0.45 x 0.35: 1 -3.265,2.75; 2 -3.265,2.25; 3 -3.265,1.75; 4 -3.265,1.25; 5 -3.265,0.75; 6 -3.265,0.25; 7 -3.265,-0.25; 8 -3.265,-0.75; 9 -3.265,-1.25; 10 -3.265,-1.75; 11 -3.265,-2.25; 12 -3.265,-2.75; 25 3.265,-2.75; 26 3.265,-2.25; 27 3.265,-1.75; 28 3.265,-1.25; 29 3.265,-0.75; 30 3.265,-0.25; 31 3.265,0.25; 32 3.265,0.75; 33 3.265,1.25; 34 3.265,1.75; 35 3.265,2.25; 36 3.265,2.75 | smd 0.35 x 0.45: 13 -2.75,-3.265; 14 -2.25,-3.265; 15 -1.75,-3.265; 16 -1.25,-3.265; 17 -0.75,-3.265; 18 -0.25,-3.265; 19 0.25,-3.265; 20 0.75,-3.265; 21 1.25,-3.265; 22 1.75,-3.265; 23 2.25,-3.265; 24 2.75,-3.265; 37 2.75,3.265; 38 2.25,3.265; 39 1.75,3.265; 40 1.25,3.265; 41 0.75,3.265; 42 0.25,3.265; 43 -0.25,3.265; 44 -0.75,3.265; 45 -1.25,3.265; 46 -1.75,3.265; 47 -2.25,3.265; 48 -2.75,3.265 | smd 5.4 x 5.4: 49 0,0
SOIC127P600X180-16N = smd 1.31 x 0.62: 1 -2.75,4.445; 2 -2.75,3.175; 3 -2.75,1.905; 4 -2.75,0.635; 5 -2.75,-0.635; 6 -2.75,-1.905; 7 -2.75,-3.175; 8 -2.75,-4.445; 9 2.75,-4.445; 10 2.75,-3.175; 11 2.75,-1.905; 12 2.75,-0.635; 13 2.75,0.635; 14 2.75,1.905; 15 2.75,3.175; 16 2.75,4.445
LED_WS2812B-B = smd 1.5 x 0.9: 1 -2.45,1.65; 2 -2.45,-1.65; 3 2.45,-1.65; 4 2.45,1.65
QFN50P400X400X95-24N = smd 0.79 x 0.26: 1 -1.97,1.25; 2 -1.97,0.75; 3 -1.97,0.25; 4 -1.97,-0.25; 5 -1.97,-0.75; 6 -1.97,-1.25; 13 1.97,-1.25; 14 1.97,-0.75; 15 1.97,-0.25; 16 1.97,0.25; 17 1.97,0.75; 18 1.97,1.25 | smd 0.26 x 0.79: 7 -1.25,-1.97; 8 -0.75,-1.97; 9 -0.25,-1.97; 10 0.25,-1.97; 11 0.75,-1.97; 12 1.25,-1.97; 19 1.25,1.97; 20 0.75,1.97; 21 0.25,1.97; 22 -0.25,1.97; 23 -0.75,1.97; 24 -1.25,1.97
SOT95P237X112-3N = smd 1.321 x 0.559: 1 -1.092,0.94; 2 -1.092,-0.94 | smd 1.321 x 0.508: 3 1.092,0
LFCSP_20 = smd 0.5 x 0.25: 1 -1.85,1; 2 -1.85,0.5; 3 -1.85,0; 4 -1.85,-0.5; 5 -1.85,-1; 11 1.85,-1; 12 1.85,-0.5; 13 1.85,0; 14 1.85,0.5; 15 1.85,1 | smd 0.25 x 0.5: 6 -1,-1.85; 7 -0.5,-1.85; 8 0,-1.85; 9 0.5,-1.85; 10 1,-1.85; 16 1,1.85; 17 0.5,1.85; 18 0,1.85; 19 -0.5,1.85; 20 -1,1.85 | smd 2.5 x 2.5: PAD 0,0

### Placement (x,y rotation side)
C4  21.09,10.71 180 bottom
C5  22.74,7.67 90 bottom
C6  34.05,3.6 90 bottom
C7  27.44,3.6 270 bottom
C8  69.99,6.27 180 top
C9  65.16,18.46 90 top
C10  66.05,14.4 90 top
C11  62.87,18.46 90 top
C12  56.91,19.1 270 top
C13  55.13,8.81 270 top
C14  59.19,4.87 270 top
C17  49.67,24.05 270 top
C18  51.83,24.05 270 top
C22  37.35,16.18 270 top
C23  31.12,17.06 270 top
C24  42.05,29 90 top
C29  17.79,4.24 270 top
C30  17.28,12.87 0 top
C31  15.63,4.24 270 top
C32  19.31,7.67 90 top
D1  35.57,2.21 0 top
D2  26.93,3.35 270 top
E1  31.12,30.4 210 top
IC2  20.96,14.27 180 bottom
J1  44.21,2.33 0 top
LA  76.46,6.65 90 bottom
LED3  12.58,3.48 270 bottom
LED4  15.63,3.48 270 bottom
LOGO2  19.31,13.61 0 top
LS1  52.97,27.61 90 bottom
Q3  25.03,14.91 90 bottom
Q4  23.12,4.49 90 top
R1  12.58,5.25 0 bottom
R2  15.76,5.25 0 bottom
R3  16.27,15.92 0 bottom
R4  47.89,28.49 180 top
R5  44.71,28.49 0 top
R6  34.05,21.51 0 top
R7  34.81,4.75 180 top
R8  31,8.17 0 top
R9  49.92,32.3 90 top
R10  13.47,4.24 90 top
R11  11.44,6.78 90 top
R12  20.96,17.57 0 bottom
R13  20.58,7.67 90 bottom
R14  25.79,9.06 180 top
R15  25.79,11.48 0 top
R16  23.38,1.57 0 top
R17  69.99,4.11 0 top
R18  67.95,18.97 180 top
R19  69.99,1.95 0 top
R20  49.92,19.35 180 bottom
R21  69.99,8.43 0 top
R22  69.99,14.91 0 top
R23  69.99,12.75 0 top
R24  60.08,18.97 180 top
R25  64.14,7.54 0 top
R26  60.08,16.56 180 top
R27  56.91,14.91 180 top
R28  54.62,11.48 0 top
R29  57.29,10.97 270 top
R30  61.35,4.87 270 top
R31  60.84,7.54 180 top
R32  69.99,10.59 0 top
RA  76.46,10.46 90 bottom
S1  34.05,17.45 270 top
SW1  54.44,29.56 270 top
T1  31,4.87 90 top
T2  35.06,8.05 270 top
T3  53.98,20.37 90 bottom
TP1  32.58,11.28 0 top
TP2  32.58,13.1 0 top
U2  16.27,11.1 270 bottom
U3  44.08,21.76 0 top
U4  44.21,13 90 top
U5  44.33,33.57 180 top
U11  15.5,8.81 0 top
U$2  30.62,3.6 0 bottom
U$3  61.99,11.86 180 top
U$10  78.89,2.82 0 top
VBAT+  29.98,9.44 90 bottom
VBAT-  29.98,12.24 90 bottom

### Tracks (layer width: path | path; a pad name or v marks a point on that pad's centre or on a via)
+3V3  (via drill 0.35)  (4 unrouted)
  Top 0.254: U$3.17 61.49,9.33 61.35,9.19 | U11.13 17.52,7.56 18.17,6.9 | R10.1 11.91,3.39 11.44,3.86 R11.1 | R29.2 58.81,10.12 59.55,10.86 U$3.15
  Top 0.305: 61.35,9.19 59.99,7.83 R31.2 58.3,7.54 58.05,7.79 58.05,9.19 57.58,9.66 56.83,9.66 | C22.1 39.42,17.03 39.76,16.68 | U4.16 39.76,16.68 | U3.37 48.52,25.03 | 48.52,25.03 48.65,25.03 | 48.65,25.03 49.03,25.03 | 49.03,25.03 49.54,25.03 C17.1 | C17.1 C18.1 51.86,24.94 v53.48,24.94 | 36.46,21.51 37.96,23.01 U3.4 U3.3 | 36.46,21.51 36.2,21.51 | 36.2,21.51 35.95,21.51 | 35.95,21.51 R6.2 | C32.1 18.26,6.82 18.17,6.9 | R5.1 43.82,28.46 43.82,28.24 | U3.46 42.33,27.87 C24.1 43.74,28.15 43.82,28.24 | U3.43 43.82,28.24 | C17.1 49.08,25.49 | 49.08,25.49 48.76,25.81 | 48.76,25.81 48.74,25.83 | 48.74,25.83 R4.1 | 48.65,25.03 48.76,25.14 | 49.08,25.49 49.08,25.19 | 49.08,25.19 49.08,25.07 49.03,25.03 | 48.76,25.81 48.76,25.45 | 48.76,25.45 48.76,25.14 | 48.76,25.14 48.81,25.19 49.08,25.19 | 48.76,25.45 48.8,25.49 49.08,25.49 | 48.74,25.83 48.74,25.24 48.52,25.03 | R4.1 48.78,28.53 | 35.95,21.51 35.74,21.29 35.74,21.04 | 36.2,21.51 35.8,21.1 35.8,20.98 | 36.24,21.29 35.99,21.04 35.99,20.79 | 36.46,21.51 36.24,21.29 | 36.24,21.29 36.24,20.53 | 36.46,21.51 v36.46,20.32 | 39.76,16.68 39.76,17.19 40.32,17.75 44.13,17.75 44.33,17.95 U3.19 | R4.1 48.52,28.71 48.52,31.03 47.63,31.92 U5.1
  Top 0.406: C32.1 19.57,6.56 v19.57,2.97 19.57,1.95 18.93,1.32 14.27,1.32 13.47,2.12 R10.1 | U4.4 v43.57,11.6 43.57,12.11 | 39.7,12.68 v39.67,12.71 39.69,12.7 42.98,12.7 43.57,12.11 | v37.35,18.46 C22.1 | v36.46,20.32 36.24,20.53 35.99,20.79 35.8,20.98 35.74,21.04 35.27,21.51 R6.2 | 43.57,12.11 43.95,12.49 | 43.95,12.49 50.05,12.49 52.88,9.66 C13.1 56.83,9.66 R29.2 | 43.95,12.49 43.92,12.52 43.16,12.52
  Bottom 0.305: LS1.P 55.64,24.94 v53.48,24.94
  Bottom 0.406: v19.57,2.97 20.2,2.97 21.47,1.7 29.85,1.7 30.82,2.66 U$2.2 33.96,2.66 C6.1 36.5,2.75 37.47,3.73 37.47,9.83 37.98,10.33 43.32,10.33 43.57,10.59 v43.57,11.6 | v39.67,12.71 39.42,12.71 37.35,14.78 v37.35,18.46 36.46,19.35 v36.46,20.32
ANTENNA_IN
  Top 0.305: E1.1 35.02,26.55 arc90 37.56,24.01 U3.2
BUTTON
  Top 0.305: U3.24 54.82,18.5 55.38,19.06 55.38,27.34 SW1.2 SW1.1
BUZZER  (via drill 0.35)
  Top 0.305: U3.27 47.92,20.01 48.78,20.87 v49.03,20.87
  Bottom 0.305: v49.03,20.87 49.07,20.84 R20.1
DTR
  Top 0.406: R7.1 35.66,6.05 | T2.E 34.61,7.1 35.66,6.05 | 35.66,6.05 35.75,6.14 36.97,6.14 37.47,6.65 37.47,12.24 38.74,13.51 43.32,13.51 43.57,13.76 U4.13
ECG_SIGNAL  (via drill 0.35)
  Top 0.254: U$3.10 60.91,13.64 56.78,13.64 56.06,14.36 R27.2 | R27.2 56.06,17.99 56.31,18.25 C12.2 | U3.5 40.8,22.53 39.63,22.53 39.38,22.27 | v42.43,17.06 42.68,16.81 52.71,16.81 54.62,14.91 R27.2
  Top 0.305: 39.38,22.27 38.36,21.26 v38.36,20.32
  Bottom 0.305: v38.36,20.32 38.36,17.57 38.87,17.06 v42.43,17.06
GND  (via drill 0.35)
  Top 0.254: U11.11 16.25,9.43 | 16.25,9.43 16.9,10.08 17.45,10.08 U11.18 | U11.1 14.38,10.06 14.87,9.57 14.87,9.44 15.38,8.94 15.76,8.94 16.25,9.43 | C17.2 v49.67,22.02 | U$3.PAD 61.86,11.86 60.99,10.98 U$3.16 60.99,9.59 60.46,9.06 v59.87,9.06 | U4.1 39.76,9.06 40.01,8.81 v42.43,8.81 | J1.A1/B12 40.46,7.09 J1.G3 J1.G1 | J1.B1/A12 47.95,7.09 J1.G4 J1.G2
  Top 0.305: R28.1 52.84,11.48 v52.21,12.11 | C23.2 v31.12,14.91 | 42.21,19.89 U3.49 42.83,21.76 42.2,21.13 v42.2,20.94 | 21.63,1.56 R16.1 | C32.2 19.31,9.99 19.16,10.14 v19.16,10.24
  Top 0.406: C29.2 v17.79,2.21 | 21.63,1.56 21.62,1.56 20.35,1.56 v20.23,1.44 | C24.2 43.86,31.67 v44.08,31.67 | U5.3 v44.33,35.23 | v42.21,19.88 42.21,19.89
  Bottom 0.305: Q3.7 25.35,20.93 v25.33,20.93 | R3.1 17.12,17.54 v17.14,17.56
  Bottom 0.406: Q3.6 Q3.7 | Q3.3 Q3.2 | v17.79,2.21 17.79,1.82 | 17.79,1.82 17.48,1.51 v12.18,1.51 | 17.79,1.82 18.17,1.44 v20.23,1.44
  other vias: 21.71,23.73 22.79,23.72 23.86,23.72 24.94,23.73 26.07,23.73 27.25,23.74 28.51,23.73 29.8,23.73 31,23.73 32.33,23.73 33.61,23.74 34.86,23.73 40.6,26.69 40.59,27.67 40.59,28.69 40.6,29.72 40.59,30.8 40.54,33.19 40.53,34.16 12.12,14.51 12.11,13.44 12.1,12.36 11.37,11.34 10.62,10.38 9.91,9.3 7.43,1.48 8.57,1.49 9.75,1.51 10.98,1.51 22.88,20.93 24.07,20.94 54.42,1.47 53.01,1.52 51.66,1.49 50.38,1.52 73.36,1.54 74.76,1.55 76.08,1.53 77.44,1.52 78.85,1.51 80.27,1.51 76.37,15.1 77.11,14.07 77.8,13.1 78.53,12.19 79.29,11.21 80.11,10.09 80.78,8.96 81.62,7.97 65.19,20.95 66.31,20.92 67.41,20.9 68.61,20.88 69.83,20.88 50.26,15.67 51.3,15.68 52.32,15.68 51.49,34.37 52.65,33.91 53.82,33.42
  pour Top (isolate 0.254): -1.9,0.17 89.93,0.17 89.93,37.26 41.41,37.26 40.09,35.93 40.09,24.26 -1.9,24.26
  pour Bottom: -1.9,24.25 -1.9,0.17 89.93,0.17 89.93,37.26 40.08,37.26 40.08,24.25
I2C_SCL  (via drill 0.35)
  Top 0.305: U11.23 14.75,16.26 20.63,22.14 v31.12,22.14 | U3.42 44.33,27.22 45.18,28.07 45.18,28.11 R5.2 45.6,28.53 v45.6,30.02
  Bottom 0.305: v45.6,30.02 43.95,30.02 43.44,29.51 43.44,23.54 42.05,22.14 v31.12,22.14
I2C_SDA  (via drill 0.35)
  Top 0.305: U11.24 14.25,16.6 20.56,22.91 v36.33,22.91 | U3.39 45.83,25.67 45.98,25.83 46.75,25.83 47.04,26.12 R4.2 47,28.53 v47,30.02
  Bottom 0.305: v36.33,22.91 41.54,22.91 42.55,23.92 42.55,30.4 42.98,30.83 46.7,30.83 47,30.53 v47,30.02
IO0  (via drill 0.35)
  Top 0.254: U3.23 46.36,18.46 v46.36,17.57
  Top 0.305: v38.49,9.57 v38.49,11.48
  Top 0.406: T2.C 36.2,8.09 v36.2,10.33
  Bottom 0.254: v46.36,17.57 46.36,10.71
  Bottom 0.305: 46.36,10.71 45.22,9.57 v38.49,9.57 | v38.49,11.48 36.71,11.48 36.2,10.97 v36.2,10.33
LA  (via drill 0.35)
  Top 0.305: R32.2 R21.2
  Top 0.406: R21.2 v72.15,8.43
  Bottom 0.406: v72.15,8.43 76.08,8.43 76.46,8.05 LA.1
N$1
  Top 0.406: T1.B 33.6,3.92 33.96,4.28 R7.2
N$2
  Top 0.406: R8.2 32.67,9 T2.B
N$3
  Top 0.305: U5.4 43.11,33.15 R9.2
N$4
  Bottom 0.406: U2.6 16.9,5.55 R2.1
N$5
  Bottom 0.305: R20.2 52.82,19.35 T3.B
N$6
  Bottom 0.406: LED3.C 11.73,3.58 R1.2
N$7
  Bottom 0.406: LED4.C 14.91,3.5 R2.2
N$8
  Top 0.254: U11.10 15.75,6.15 15.88,6.02 17.54,6.02 17.79,5.76 C29.1
N$9
  Bottom 0.406: R1.1 13.43,6.23 13.85,6.65 14.74,6.65 15.63,7.54 U2.7
N$10
  Top 0.305: C8.2 66.47,8.94 63.64,8.94 62.99,9.59 U$3.20
  Top 0.406: R17.1 C8.2
N$11  (via drill 0.35)
  Top 0.254: v65.03,10.08 64.26,10.86 U$3.1 | C8.1 71.09,6.02 71.64,6.02 72.02,6.4 v72.02,6.9
  Bottom 0.254: v72.02,6.9 71.64,7.29 67.83,7.29 v65.03,10.08
N$12
  Top 0.305: R25.1 63.26,7.58 63.26,8.3 62.49,9.07 U$3.19
  Top 0.406: R19.1 63.89,1.95 63.29,2.55 R25.1
N$13
  Top 0.305: R18.1 72.53,18.97 73.29,18.21 73.29,5.13 72.27,4.11 R17.2 R19.2
N$14
  Top 0.254: U$3.6 63.58,13.71 64.14,14.27 64.14,16.05 65.16,17.06 C9.1
  Top 0.305: R18.2 67.1,18.12 66.6,17.61 C9.1
N$16  (via drill 0.35)
  Top 0.305: R25.2 66.18,7.54 66.43,7.29 66.43,6.14 66.18,5.89 v65.16,5.89 | v59.19,20.75 58.94,21 57.29,21 56.91,20.62 C12.1 58.25,19.95 R24.2
  Bottom 0.305: v65.16,5.89 60.08,5.89 59.19,6.78 v59.19,20.75
N$17
  Bottom 0.406: U2.2 15.63,15.71 R3.2
N$18
  Top 0.254: U$3.2 65.03,11.36 65.03,11.35
  Top 0.305: R21.1 67.95,8.43 65.03,11.35
N$19
  Top 0.254: U$3.3 66.3,11.86
  Top 0.305: 66.3,11.86 67.07,11.86 67.83,12.62 67.83,14.52 68.21,14.91 R22.1
N$20  (1 unrouted)
  Top 0.406: J1.A4/B9 41.81,7.78 41.28,8.3 38.87,8.3 38.24,7.67 38.24,2.84 37.6,2.21 D1.A
N$21
  Bottom 0.406: IC2.1 19.41,15.57 18.93,16.05 18.93,18.72 19.44,19.22 23.63,19.22 24.05,18.8 Q3.5
N$22
  Bottom 0.305: LS1.N 51.64,24.11 53.22,22.53 54.49,22.53 55.08,21.93 T3.C
N$23
  Bottom 0.406: Q3.4 24.05,13.85 22.33,15.57 IC2.3
N$24
  Top 0.254: R10.2 13.47,6.65 13.66,6.84 U11.7
N$25
  Top 0.254: R11.2 11.51,7.56 U11.6
N$26
  Top 0.254: U11.8 14.75,5.37 15.03,5.09 C31.1
N$27
  Top 0.305: U11.20 16.25,12.7 C30.1
N$28
  Bottom 0.406: R12.2 20.96,16.72 IC2.2
N$29
  Bottom 0.406: R13.2 20.24,8.86 C4.1 20.96,11.44 IC2.5
N$30
  Top 0.254: C10.1 66.05,13 65.41,12.36 U$3.4
N$31  (via drill 0.35)
  Top 0.254: C10.2 65.38,15.25 64.65,14.52 64.65,13 64.51,12.86 U$3.5
  Top 0.305: R23.1 R32.1 v67.83,10.59 | v66.43,16.68 66.05,16.3 C10.2
  Bottom 0.305: v67.83,10.59 67.32,11.1 67.32,16.3 66.94,16.68 v66.43,16.68
N$34  (via drill 0.35)
  Top 0.254: U$3.7 62.49,15.79 | C11.1 63,17.48 v63,16.3
  Top 0.305: v62.75,20.75 61.6,20.75 60.93,20.07 R24.1 | v63,16.3 62.49,15.79
  Bottom 0.305: v62.75,20.75 63,20.75 63.38,20.37 63.38,16.68 v63,16.3
N$36
  Top 0.254: U$3.9 61.49,14.77 61.35,14.91 60.97,14.91
  Top 0.305: 60.97,14.91 59.57,14.91 59.19,15.29 59.19,16.52 R26.2 58.18,16.56 57.76,16.14 R27.1
N$38
  Top 0.254: U$3.14 59.18,11.36 58.68,11.86 57.33,11.86 R29.1 55.81,11.82 R28.2
N$39
  Top 0.254: 61.84,7.69 R31.1
  Top 0.305: U$3.18 61.99,7.83 61.84,7.69 | R31.1 61.69,6.06 R30.1 C14.1
RA  (via drill 0.35)
  Top 0.305: R23.2 R22.2
  Top 0.406: R23.2 v72.27,12.75
  Bottom 0.406: v72.27,12.75 75.83,12.75 76.46,12.11 RA.1
REFOUT
  Top 0.254: U$3.8 61.99,15.79
  Top 0.305: C9.2 C11.2 62.07,19.31 61.86,19.1 61.86,18.08 61.22,17.45 61.22,16.85 R26.1 61.22,16.56 61.99,15.79
RGB
  Top 0.305: R9.1 49.92,26.72 50.56,26.08 54.11,26.08 54.62,25.57 54.62,19.94 53.69,19.01 U3.25
RST
  Top 0.305: U3.9 40.42,20.51 39.42,19.52 S1.1 33.62,19.52 | 33.62,19.52 33.16,19.99 | 33.16,19.99 33.16,21.47 R6.1 | C23.1 31.12,17.95 | 31.12,17.95 31.12,18.59 32.06,19.52 32.65,19.52 | 32.65,19.52 33.16,19.52 | 33.62,19.52 33.16,19.52 | 33.16,19.52 33.16,19.99 | 33.16,19.99 33.11,19.99 32.65,19.52 | T1.C 28.71,6.06 28.71,16.68 29.98,17.95 31.12,17.95
RTS
  Top 0.406: T1.E 31.4,6.52 30.49,6.52 30.15,6.87 R8.1 30.15,9.1 31,9.95 34.43,9.95 35.32,10.84 35.32,11.73 37.73,14.14 41.67,14.14 42.3,14.78 U4.14
UART0_RX  (via drill 0.35)
  Top 0.254: U4.2 v41.03,11.6
  Top 0.305: U3.40 45.33,25.93 v46.24,26.84
  Bottom 0.305: v41.03,11.6 41.03,11.96 44.33,15.26 44.33,27.35 44.59,27.61 45.98,27.61 46.24,27.35 v46.24,26.84
UART0_TX  (via drill 0.35)
  Top 0.254: v42.3,11.6 U4.3
  Top 0.305: U3.41 44.83,26.58 v45.09,26.84
  Bottom 0.305: v45.09,26.84 45.09,15.29 42.3,12.49 v42.3,11.6
USB_D+
  Top 0.254: J1.B6 44.97,7.08 44.97,6.27 44.71,6.02 44.21,6.02 43.96,6.27 J1.A6 43.96,8.18 44.84,9.06 U4.5
USB_D-  (via drill 0.35)
  Top 0.254: J1.A7 44.46,7.79 45.09,8.43 v45.35,8.43 45.86,8.43 46.11,8.68 U4.6 | v43.44,8.81 v43.46,8.8 J1.B7
  Bottom 0.254: v45.35,8.43 44.97,8.81 v43.44,8.81
VBAT  (via drill 0.35)
  Top 0.305: v29.94,10.84 30.37,11.28 TP1.TP
  Top 0.406: v20.58,4.75 21.77,4.75 Q4.3 | v23.5,10.08 24.77,10.08 25.03,9.83 25.03,9.15 R14.2
  Bottom 0.305: VBAT+.1 29.94,9.48 v29.94,10.84
  Bottom 0.406: 19.69,6.82 19.4,6.82 19.06,7.16 19.06,8.17 18.61,8.62 U2.5 | 19.69,6.82 R13.1 C5.1 24.18,6.82 25.28,7.92 | 25.28,7.92 25.56,8.2 | 25.56,8.2 25.7,8.33 | 25.7,8.33 26.01,8.65 | 26.01,8.65 26.14,8.78 | 26.14,8.78 26.33,8.97 | 26.33,8.97 26.81,9.44 | 19.69,6.82 19.69,5.38 20.33,4.75 v20.58,4.75 | 24.87,9.44 24.14,9.44 v23.5,10.08 | 24.87,9.44 25.29,9.44 | 25.8,9.44 25.29,9.44 | 25.8,9.44 26.06,9.44 | 26.06,9.44 26.81,9.44 | 26.81,9.44 VBAT+.1 | VBAT+.1 30.58,9.44 30.64,9.51 30.04,9.51 VBAT+.1 | 26.06,9.44 26.33,9.17 26.33,8.97 | 25.8,9.44 26.14,9.1 26.14,8.78 | 25.56,9.18 25.7,9.04 | 25.7,9.04 26.01,8.73 26.01,8.65 | 25.7,9.04 25.7,8.33 | 25.29,9.44 25.56,9.18 | 25.56,9.18 25.56,8.2 | 25.29,9.44 25.28,9.44 25.28,9.03 | 25.28,7.92 25.28,8.97 25.28,9.03 | 24.87,9.44 25.28,9.03
VBAT_SENSE  (via drill 0.35)
  Top 0.305: U3.8 40.8,21 v39.68,21 | v31.12,21 27.31,21 26.64,20.33 26.64,10.97
  Top 0.406: R14.1 26.64,10.97 R15.2
  Bottom 0.305: v39.68,21 v31.12,21
VCC  (via drill 0.35)
  Top 0.406: D2.C 26.52,5.44 25.66,5.44 | 25.66,5.44 25.28,5.44 | 25.28,5.44 24.9,5.44 | 24.9,5.44 24.65,5.44 | 24.65,5.44 Q4.2 24.22,5.97 24.65,6.4 | v25.41,6.4 24.9,6.4 | 24.9,6.4 24.65,6.4 | 24.65,6.4 24.65,5.44 | 24.9,6.4 24.9,5.44 | v25.41,6.4 25.28,6.27 25.28,5.44 | 25.66,5.44 25.41,5.7 v25.41,6.4
  Bottom 0.406: U$2.3 29.52,4.06 29.13,4.45 C7.1 27.44,5.89 26.93,6.4 v25.41,6.4
VUSB  (via drill 0.35)
  Top 0.406: D1.K 33.87,1.67 D2.A 26.1,1.67 | 24.77,1.67 24.33,1.67 R16.2 24.23,2.33 | 24.77,1.67 25.15,1.67 | 25.15,1.67 25.53,1.67 | 25.53,1.67 25.92,1.67 | 25.92,1.67 26.1,1.67 | 24.23,2.33 24.23,2.59 | 24.23,2.59 24.23,2.97 | 24.23,2.97 24.23,3.22 | 24.23,3.22 Q4.1 25.92,1.85 | 24.23,2.33 24.77,1.79 24.77,1.67 | 24.23,2.59 25.15,1.67 | 24.23,2.97 25.53,1.67 | 25.92,1.67 25.92,1.85 | 25.92,1.85 26.1,1.67 | v22.36,3.22 24.23,3.22
  Bottom 0.406: 13.73,8.56 13.09,9.19 | 13.73,8.56 14.3,8.56 U2.8 | 13.09,9.19 13.09,16.3 15.63,18.84 17.66,18.84 18.17,18.33 U2.4 | 13.73,2.46 16.14,2.46 16.39,2.71 16.39,3.46 LED4.A 16.63,3.22 18.04,3.22 18.68,3.86 20.96,3.86 21.6,3.22 v22.36,3.22 | 13.73,8.56 13.09,8.56 | 13.09,8.56 12.46,8.56 | 12.46,8.56 10.68,8.56 10.17,8.05 10.17,2.84 10.55,2.46 13.73,2.46 | 13.09,9.19 13.09,8.56 | 13.09,9.19 12.46,8.56 | 13.73,2.46 13.33,2.85 LED3.A

### Text on the board
tPlace: SI-SCA | ver.1.0 | C:/Users/azzmi/Desktop/Others/3DP 2 BMP.bmp | C:/Users/azzmi/Desktop/Others/3DP 2 BMP.bmp